# EAGLE design FTDI Basic-v22-3.3V (EAGLE 5.10)
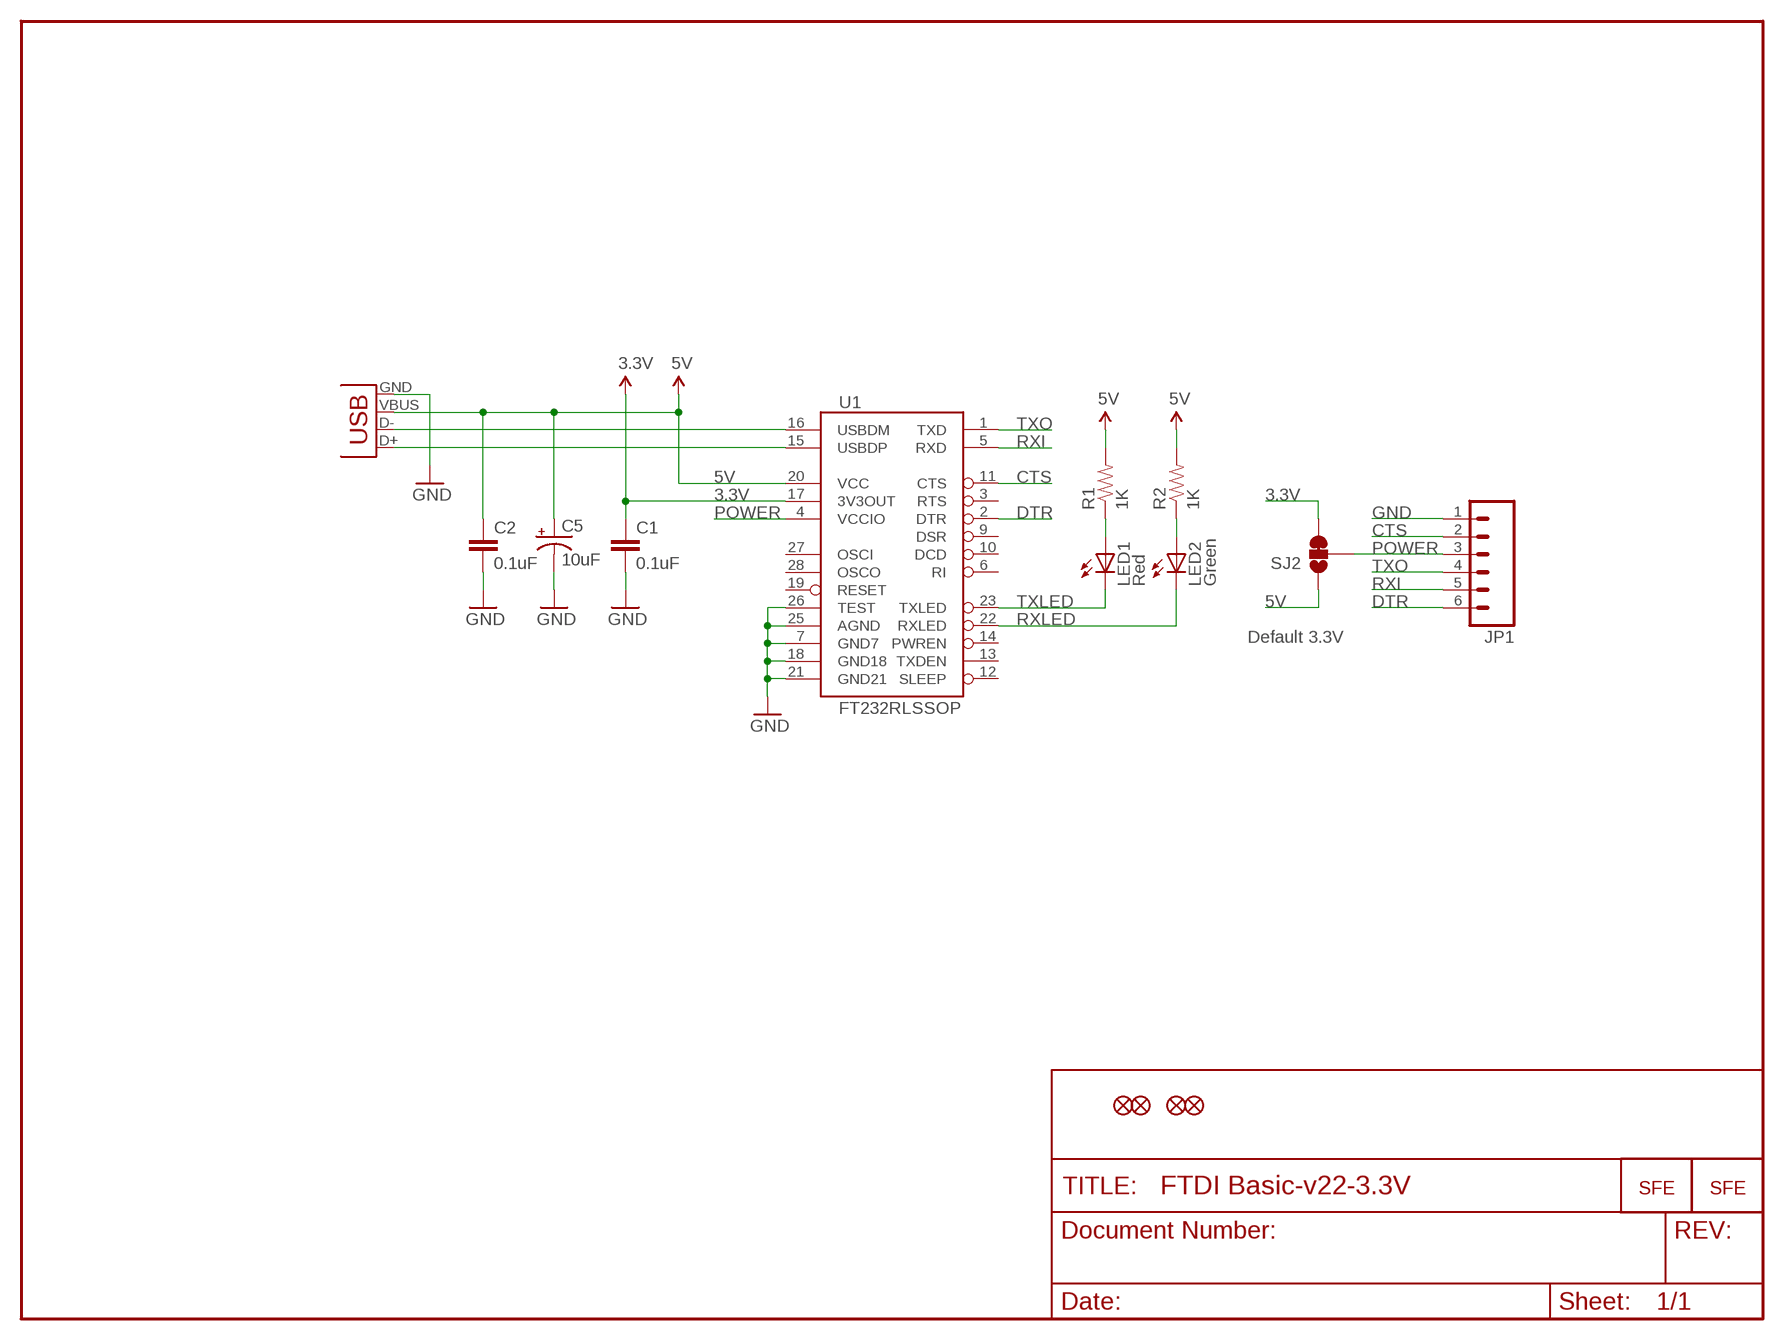
[diagram p0: schematic, sheet 1]

## Parts
C1  0.1uF  CAP0402-CAP  [0402-CAP]
C2  0.1uF  CAP0402-CAP  [0402-CAP]
C5  10uF  CAP_POL1206  [EIA3216]
JP1  M06SMD-FEMALE-V2  [1X06-SMD-FEMALE-V2]
JP2  LOGO-SFESK  [SFE-LOGO-FLAME]
JP3  FIDUCIAL1X2  [FIDUCIAL-1X2]
JP4  FIDUCIAL1X2  [FIDUCIAL-1X2]
JP5  FIDUCIAL1X2  [FIDUCIAL-1X2]
JP6  FIDUCIAL1X2  [FIDUCIAL-1X2]
LED1  Red  LED0603  [LED-0603]
LED2  Green  LED0603  [LED-0603]
R1  1K  RESISTOR0402-RES  [0402-RES]
R2  1K  RESISTOR0402-RES  [0402-RES]
SJ2  SOLDERJUMPER_2WAYS  [SJ_3]
U1  FT232RLSSOP  [SSOP28DB]
U$2  LOGO-SFENW2  [SFE-NEW-WEB]
X2  USB-SMD-NS  [USB-MINIB-NOSTOP]

## Nets
3.3V [power]: C1.1 SJ2.3 U1.17(3V3OUT)
5V: C2.1 C5.A(+) R1.2 R2.2 SJ2.1 U1.20(VCC) X2.VBUS
CTS: JP1.2 U1.11(CTS)
DTR: JP1.6 U1.2(DTR)
GND [power]: C1.2 C2.2 C5.C(-) JP1.1 U1.7(GND7) U1.18(GND18) U1.21(GND21) U1.25(AGND) U1.26(TEST) X2.GND
N$1: LED1.A R1.1
N$2: LED2.A R2.1
POWER: JP1.3 SJ2.2 U1.4(VCCIO)
RXI: JP1.5 U1.5(RXD)
RXLED: LED2.C U1.22(RXLED)
TXLED: LED1.C U1.23(TXLED)
TXO: JP1.4 U1.1(TXD)
USB_D+: U1.15(USBDP) X2.D+
USB_D-: U1.16(USBDM) X2.D-
Unconnected: U1.3(RTS) U1.6(RI) U1.9(DSR) U1.10(DCD) U1.12(SLEEP) U1.13(TXDEN) U1.14(PWREN) U1.19(RESET) U1.27(OSCI) U1.28(OSCO)

## Notes on the sheet
- Default 3.3V

## Library data of the parts
C1 C2 = SparkFun:CAP: Capacitor Standard 0603 ceramic capacitor, and 0.1" leaded capacitor.
C5 = SparkFun:CAP_POL: Capacitor Polarized These are standard SMD and PTH capacitors. Normally 10uF, 47uF, and 100uF in electrolytic and tantalum varieties. Always verify the external diameter of the through hole cap, it varies with capacity, voltage, and manufacturer. The EIA devices should be standard.
JP1 = SparkFun:M06: Header 6 Standard 6-pin 0.1" header. Use with straight break away headers (SKU : PRT-00116), right angle break away headers (PRT-00553), swiss pins (PRT-00743), machine pins (PRT-00117), and female headers (PRT-00115). Molex polarized connector foot print use with SKU : PRT-08094 with associated crimp pins and housings. NOTES ON THE VARIANTS LOCK and LOCK_LONGPADS... This footprint was designed to help hold the alignment of a through-hole component (i.e. 6-pin header) while soldering it into place. You may notice that each hole has been shifted either up or down by 0.005 of an inch from it's more standard position (which is a perfectly straight line). This slight alteration caused the pins (the squares in the middle) to touch the edges of the holes. Because they are alternating, it causes a "brace" to hold the component in place. 0.005 has proven to be the perfect amount of "off-center" position when using our standard breakaway headers. Although looks a little odd when you look at the bare footprint, once you have a header in there, the alteration is very hard to notice. Also, if you push a header all the way into place, it is covered up entirely on the bottom side. This idea of altering the position of holes to aid alignment will be further integrated into the Sparkfun Library for other footprints. It can help hold any component with 3 or more connection pins.
JP2 U$2 = SparkFun:LOGO-SFE: Spark Fun Electronics PCB Logo This is the standard Spark Fun Electronics PCB logo.
JP3-JP6 = SparkFun:FIDUCIAL: Fiducial Alignment Points Various fiducial points for machine vision alignment.
LED1 LED2 = SparkFun:LED: LEDs Standard schematic elements and footprints for 5mm, 3mm, 1206, and 0603 sized LEDs. 5mm - Spark Fun Electronics SKU : COM-00529 (and others)
R1 R2 = SparkFun:RESISTOR: Resistor Basic schematic elements and footprints for 0603, 1206, and PTH resistors.
SJ2 = SparkFun:SOLDERJUMPER_2WAY: Solder Jumper 2 way solder jumper
U1 = SparkFun:FT232RL: USB UART FT232RL 4th Generation USB UART (USB <-> Serial) Controller. Spark Fun Electronics SKU : COM-00650
X2 = SparkFun:USB: USB Connectors USB-B-PTH is fully proven SKU : PRT-00139 USB-miniB is fully proven SKU : PRT-00587 USB-A-PCB is untested. USB-A-H is throughly reviewed, but untested. Spark Fun Electronics SKU : PRT-00437 USB-B-SMT is throughly reviewed, but untested. Needs silkscreen touching up. USB-A-S has not been used/tested USB-MB-H has not been used/tested

## Net classes
0 default: width 0.203 mm
1 power: width 0.254 mm

## Board
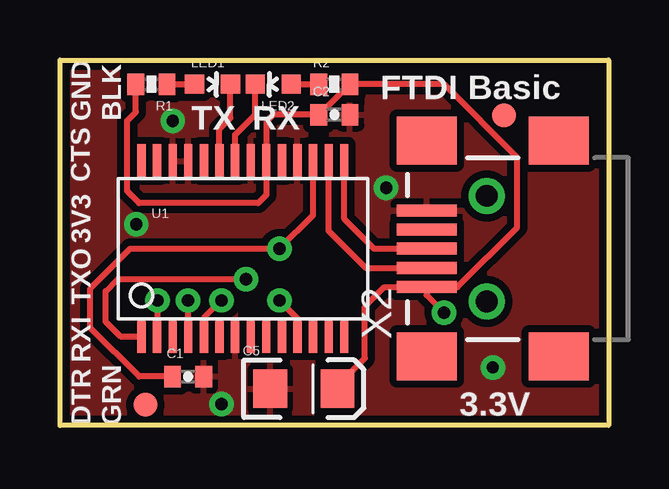
[diagram p1: board, top side]
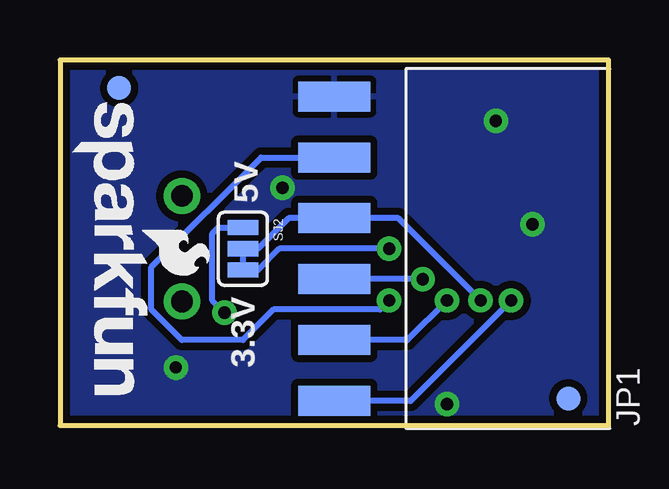
[diagram p2: board, bottom side, seen from below]

Size 22.86 x 15.24 mm. Coordinates in mm from the lower left corner, seen from the top.
Outline: 0,15.24 22.86,15.24 22.86,0 0,0 0,15.24
Copper layers (1*16): Top 0.035mm / dielectric 1.5mm / Bottom 0.035mm
Design rules "SparkFun": minimum track width 8mil, minimum drill 20mil, track to track 8mil, track to pad 8mil, pad to pad 8mil, via to via 8mil, smd to smd 8mil, copper to edge 8mil, drill to drill 8mil, minimum pad ring 12mil, minimum via ring 10mil, stop-mask expansion 4mil, vias tented up to drill 20mil, thermal gap 10mil

### Footprints (pad centres in the part's own frame; a part is rotated, then mirrored left to right if it is on the bottom)
0402-CAP = smd 0.7 x 0.9: 1 -0.65,0; 2 0.65,0
EIA3216 = smd 1.4 x 1.6: A 1.4,0; C -1.4,0
1X06-SMD-FEMALE-V2 = smd 1.25 x 3: 1 6.35,3.425; 2 3.81,3.425; 3 1.27,3.425; 4 -1.27,3.425; 5 -3.81,3.425; 6 -6.35,3.425
FIDUCIAL-1X2 = smd 1 x 1: 1 0,0
LED-0603 = smd 0.8 x 0.8: A 0,-0.75; C 0,0.75
0402-RES = smd 0.7 x 0.9: 1 -0.65,0; 2 0.65,0
SJ_3 = smd 0.635 x 1.27: 1 -0.889,0; 2 0,0; 3 0.889,0
SSOP28DB = smd 0.348 x 1.397: 1 -4.225,-3.656; 2 -3.575,-3.656; 3 -2.925,-3.656; 4 -2.275,-3.656; 5 -1.625,-3.656; 6 -0.975,-3.656; 7 -0.325,-3.656; 8 0.325,-3.656; 9 0.975,-3.656; 10 1.625,-3.656; 11 2.275,-3.656; 12 2.925,-3.656; 13 3.575,-3.656; 14 4.225,-3.656; 15 4.225,3.656; 16 3.575,3.656; 17 2.925,3.656; 18 2.275,3.656; 19 1.625,3.656; 20 0.975,3.656; 21 0.325,3.656; 22 -0.325,3.656; 23 -0.975,3.656; 24 -1.625,3.656; 25 -2.275,3.656; 26 -2.925,3.656; 27 -3.575,3.656; 28 -4.225,3.656
USB-MINIB-NOSTOP = smd 2.5 x 0.5: D+ 2.5,0; D- 2.5,0.8; GND 2.5,-1.6; ID 2.5,-0.8; VBUS 2.5,1.6 | smd 2.5 x 2: G1 -3,-4.5; G2 -3,4.5; G3 2.5,4.5; G4 2.5,-4.5 | drill 0.9 pad 0.8 round: H1 0,2.2 | drill 0.9 pad 0.787 round: H2 0,-2.2

### Placement (x,y rotation side)
C1  5.33,2.03 0 top
C2  11.43,12.95 0 top
C5  10.16,1.52 0 top
JP1  8,7.37 90 bottom
JP2  19.43,8.13 270 bottom
JP3  3.56,0.86 0 top
JP4  18.49,12.93 0 top
JP5  1.68,1.12 0 bottom
JP6  20.4,14.07 0 bottom
LED1  6.35,14.22 270 top
LED2  8.89,14.22 90 top
R1  3.81,14.22 180 top
R2  11.43,14.22 0 top
SJ2  15.24,7.37 270 bottom
U1  7.62,7.37 0 top
U$2  22.35,13.46 270 bottom
X2  17.78,7.37 180 top

### Tracks (layer width: path | path; a pad name or v marks a point on that pad's centre or on a via)
3.3V  (via drill 0.51)
  Top 0.254: U1.17 10.54,8.77 v9.14,7.37 2.92,7.37 1.27,5.71 1.27,4.06 3.3,2.03 C1.1
  Bottom 0.254: SJ2.3 14.61,6.48 13.72,7.37 v9.14,7.37
5V  (via drill 0.51)
  Top 0.254: X2.VBUS 16.56,5.77 19.05,8.26 19.05,11.18 16,14.22 R2.2 12.06,14.22 10.79,12.95 C2.1 8.89,12.95 8.6,12.66 U1.20 8.6,9.61 8.26,9.27 3.3,9.27 2.79,9.78 2.79,12.7 3.16,13.07 R1.2 | X2.VBUS 15.28,5.42 v16,4.7 | C5.A 11.56,1.65 12.7,2.79 12.7,4.95 13.51,5.77 X2.VBUS
  Bottom 0.254: SJ2.1 16.26,8.26 16.51,8 16.51,5.21 v16,4.7
CTS  (via drill 0.51)
  Top 0.254: U1.11 9.89,4.46 v9.14,5.21
  Bottom 0.254: JP1.2 14.48,11.18 19.05,6.6 19.05,4.83 17.78,3.56 15.24,3.56 13.97,4.83 9.53,4.83 v9.14,5.21
DTR  (via drill 0.51)
  Top 0.254: U1.2 4.06,3.73 v4.06,5.21
  Bottom 0.254: JP1.6 8.26,1.02 v4.06,5.21
GND  (via drill 0.51)
  other vias: 18.03,2.41 4.7,12.7 3.17,8.38 6.73,0.89 13.59,9.91
  pour Bottom (isolate 0.305): 0,0 0,15.24 22.86,15.24 22.86,0
  pour Top (isolate 0.305): 0,0 0,15.24 22.86,15.24 22.86,0
N$1
  Top 0.254: R1.1 LED1.A
N$2
  Top 0.254: LED2.A R2.1
POWER  (via drill 0.51)
  Top 0.254: v5.33,5.21 5.33,3.72 U1.4
  Bottom 0.254: 15.24,6.6 SJ2.2 14.61,7.37 13.34,8.64 JP1.3 8.76,8.64 v5.33,5.21
RXI  (via drill 0.51)
  Top 0.254: U1.5 6,4.47 v6.73,5.21
  Bottom 0.254: v6.73,5.21 8.38,3.56 JP1.5
RXLED
  Top 0.254: U1.22 7.29,12.12 8.14,12.97 LED2.C
TXLED
  Top 0.254: U1.23 6.64,12.36 7.1,12.82 LED1.C
TXO  (via drill 0.51)
  Top 0.254: U1.1 2.51,3.71 1.91,4.32 1.91,5.59 2.41,6.1 v7.75,6.1
  Bottom 0.254: v7.75,6.1 JP1.4
USB_D+
  Top 0.254: X2.D+ 13.08,7.37 11.85,8.6 U1.15
USB_D-
  Top 0.254: X2.D- 12.74,6.57 11.2,8.11 U1.16

### Text on the board
tPlace: FTDI Basic | GND | BLK | TX | RX | CTS | 3V3 | TXO | RXI | 3.3V | DTR | GRN
bPlace: 5V | 3.3V
tValues: Close